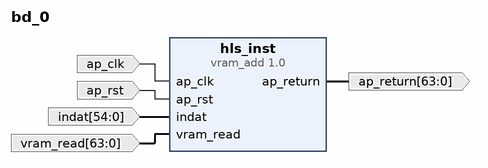
[diagram p0: block diagram of the top level]
# Vivado block design bd_0, xc7z020clg400-2, Vivado 2024.1
create_bd_design bd_0

create_bd_port -dir I -type clk ap_clk
set_property -dict {CONFIG.FREQ_HZ 359000000.0} [get_bd_ports ap_clk]
create_bd_port -dir O -from 63 -to 0 -type data ap_return
create_bd_port -dir I -type rst ap_rst
set_property -dict {CONFIG.POLARITY ACTIVE_HIGH} [get_bd_ports ap_rst]
create_bd_port -dir I -from 54 -to 0 -type data indat
create_bd_port -dir I -from 63 -to 0 -type data vram_read

create_bd_cell -type ip -vlnv xilinx.com:hls:vram_add:1.0 hls_inst

# ---- connections ----

connect_bd_net -net ap_clk_0_1 [get_bd_ports ap_clk] [get_bd_pins hls_inst/ap_clk]
connect_bd_net -net ap_rst_0_1 [get_bd_ports ap_rst] [get_bd_pins hls_inst/ap_rst]
connect_bd_net [get_bd_pins hls_inst/ap_return] [get_bd_ports ap_return]
connect_bd_net -net indat_0_1 [get_bd_ports indat] [get_bd_pins hls_inst/indat]
connect_bd_net -net vram_read_0_1 [get_bd_ports vram_read] [get_bd_pins hls_inst/vram_read]

validate_bd_design
save_bd_design
